# EAGLE schematic speakerbadge_thruvias (EAGLE 5.11)

## Sheet 1 of 2
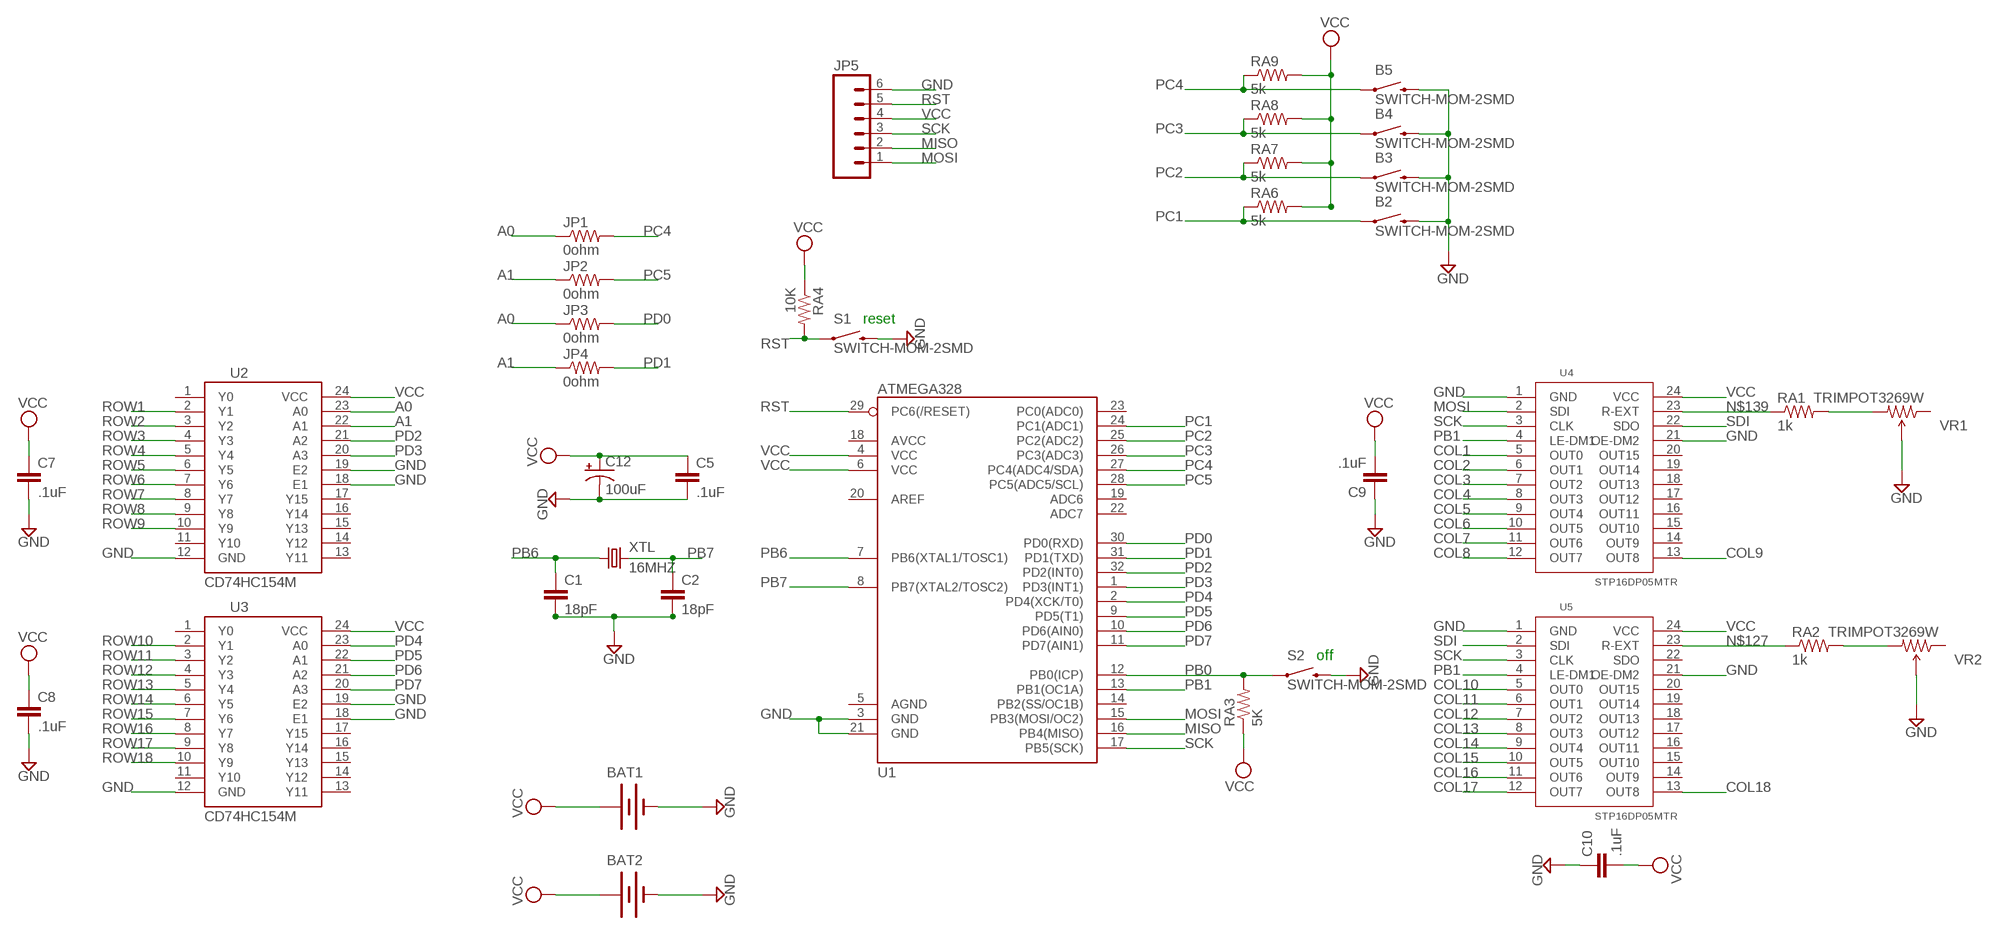
[diagram p0: schematic, sheet 1]

### Parts
B2  SWITCH-MOM-2SMD  SWITCH-MOMENTARY-2SMD  [TACTILE_SWITCH_SMD]
B3  SWITCH-MOM-2SMD  SWITCH-MOMENTARY-2SMD  [TACTILE_SWITCH_SMD]
B4  SWITCH-MOM-2SMD  SWITCH-MOMENTARY-2SMD  [TACTILE_SWITCH_SMD]
B5  SWITCH-MOM-2SMD  SWITCH-MOMENTARY-2SMD  [TACTILE_SWITCH_SMD]
BAT1  NSL_SPARKFUN_BATTERY245MM  [NSL_SPARKFUN_BATTCON_245MM]
BAT2  NSL_SPARKFUN_BATTERY245MM  [NSL_SPARKFUN_BATTCON_245MM]
C1  18pF  SPARKFUN_CAP0603-CAP  [SPARKFUN_0603-CAP]
C2  18pF  SPARKFUN_CAP0603-CAP  [SPARKFUN_0603-CAP]
C5  .1uF  SPARKFUN_CAP0603-CAP  [SPARKFUN_0603-CAP]
C7  .1uF  SPARKFUN_CAP0603-CAP  [SPARKFUN_0603-CAP]
C8  .1uF  SPARKFUN_CAP0603-CAP  [SPARKFUN_0603-CAP]
C9  .1uF  SPARKFUN_CAP0603-CAP  [SPARKFUN_0603-CAP]
C10  .1uF  SPARKFUN_CAP0603-CAP  [SPARKFUN_0603-CAP]
C12  100uF  CAP_POLD  [PANASONIC_D]
JP1  0ohm  SPARKFUN_RESISTOR0603-RES  [SPARKFUN_0603-RES]
JP2  0ohm  SPARKFUN_RESISTOR0603-RES  [SPARKFUN_0603-RES]
JP3  0ohm  SPARKFUN_RESISTOR0603-RES  [SPARKFUN_0603-RES]
JP4  0ohm  SPARKFUN_RESISTOR0603-RES  [SPARKFUN_0603-RES]
JP5  M061X06-SMD_EDGE_FEMALE  [1X06-SMD_EDGE]
RA1  1k  SPARKFUN_RESISTOR0603-RES  [SPARKFUN_0603-RES]
RA2  1k  SPARKFUN_RESISTOR0603-RES  [SPARKFUN_0603-RES]
RA3  5K  SPARKFUN_RESISTOR0603-RES  [SPARKFUN_0603-RES]
RA4  10K  SPARKFUN_RESISTOR0603-RES  [SPARKFUN_0603-RES]
RA6  5k  SPARKFUN_RESISTOR0603-RES  [SPARKFUN_0603-RES]
RA7  5k  SPARKFUN_RESISTOR0603-RES  [SPARKFUN_0603-RES]
RA8  5k  SPARKFUN_RESISTOR0603-RES  [SPARKFUN_0603-RES]
RA9  5k  SPARKFUN_RESISTOR0603-RES  [SPARKFUN_0603-RES]
S1  SWITCH-MOM-2SMD  SWITCH-MOMENTARY-2SMD  [TACTILE_SWITCH_SMD]
S2  SWITCH-MOM-2SMD  SWITCH-MOMENTARY-2SMD  [TACTILE_SWITCH_SMD]
U1  ATMEGA328  ATMEGA168  [TQFP32-08]
U2  CD74HC154M  [SO-24DW]
U3  CD74HC154M  [SO-24DW]
U4  STP16DP05MTR  [STP16DP05MTR]
U5  STP16DP05MTR  [STP16DP05MTR]
VR1  TRIMPOT3269W  [3269W]
VR2  TRIMPOT3269W  [3269W]
XTL  16MHZ  CRYSTALSMD  [HC49UP]

### Nets
A0: JP1.1 JP3.1 U2.23(A0)
A1: JP2.1 JP4.1 U2.22(A1)
COL1: U4.5(OUT0) ; also sheet 2
COL2: U4.6(OUT1) ; also sheet 2
COL3: U4.7(OUT2) ; also sheet 2
COL4: U4.8(OUT3) ; also sheet 2
COL5: U4.9(OUT4) ; also sheet 2
COL6: U4.10(OUT5) ; also sheet 2
COL7: U4.11(OUT6) ; also sheet 2
COL8: U4.12(OUT7) ; also sheet 2
COL9: U4.13(OUT8) ; also sheet 2
COL10: U5.5(OUT0) ; also sheet 2
COL11: U5.6(OUT1) ; also sheet 2
COL12: U5.7(OUT2) ; also sheet 2
COL13: U5.8(OUT3) ; also sheet 2
COL14: U5.9(OUT4) ; also sheet 2
COL15: U5.10(OUT5) ; also sheet 2
COL16: U5.11(OUT6) ; also sheet 2
COL17: U5.12(OUT7) ; also sheet 2
COL18: U5.13(OUT8) ; also sheet 2
GND: B2.3 B3.3 B4.3 B5.3 BAT1.2(-) BAT2.2(-) C1.2 C2.2 C5.2 C7.2 C8.2 C9.1 C10.1 C12.- JP5.6 S1.3 S2.3 U1.3(GND) U1.21(GND) U2.12(GND) U2.18(E1) U2.19(E2) U3.12(GND) U3.18(E1) U3.19(E2) U4.1(GND) U4.21(OE-DM2) U5.1(GND) U5.21(OE-DM2) VR1.2(WIPER) VR2.2(WIPER)
MISO: JP5.2 U1.16(PB4(MISO))
MOSI: JP5.1 U1.15(PB3(MOSI/OC2)) U4.2(SDI)
N$37: RA1.2 VR1.3(CW)
N$38: RA2.2 VR2.3(CW)
N$127: RA2.1 U5.23(R-EXT)
N$139: RA1.1 U4.23(R-EXT)
PB0: RA3.2 S2.1 U1.12(PB0(ICP))
PB1: U1.13(PB1(OC1A)) U4.4(LE-DM1) U5.4(LE-DM1)
PB6: C1.1 U1.7(PB6(XTAL1/TOSC1)) XTL.1
PB7: C2.1 U1.8(PB7(XTAL2/TOSC2)) XTL.2
PC1: B2.1 RA6.1 U1.24(PC1(ADC1))
PC2: B3.1 RA7.1 U1.25(PC2(ADC2))
PC3: B4.1 RA8.1 U1.26(PC3(ADC3))
PC4: B5.1 JP1.2 RA9.1 U1.27(PC4(ADC4/SDA))
PC5: JP2.2 U1.28(PC5(ADC5/SCL))
PD0: JP3.2 U1.30(PD0(RXD))
PD1: JP4.2 U1.31(PD1(TXD))
PD2: U1.32(PD2(INT0)) U2.21(A2)
PD3: U1.1(PD3(INT1)) U2.20(A3)
PD4: U1.2(PD4(XCK/T0)) U3.23(A0)
PD5: U1.9(PD5(T1)) U3.22(A1)
PD6: U1.10(PD6(AIN0)) U3.21(A2)
PD7: U1.11(PD7(AIN1)) U3.20(A3)
ROW1: U2.2(Y1) ; also sheet 2
ROW2: U2.3(Y2) ; also sheet 2
ROW3: U2.4(Y3) ; also sheet 2
ROW4: U2.5(Y4) ; also sheet 2
ROW5: U2.6(Y5) ; also sheet 2
ROW6: U2.7(Y6) ; also sheet 2
ROW7: U2.8(Y7) ; also sheet 2
ROW8: U2.9(Y8) ; also sheet 2
ROW9: U2.10(Y9) ; also sheet 2
ROW10: U3.2(Y1) ; also sheet 2
ROW11: U3.3(Y2) ; also sheet 2
ROW12: U3.4(Y3) ; also sheet 2
ROW13: U3.5(Y4) ; also sheet 2
ROW14: U3.6(Y5) ; also sheet 2
ROW15: U3.7(Y6) ; also sheet 2
ROW16: U3.8(Y7) ; also sheet 2
ROW17: U3.9(Y8) ; also sheet 2
ROW18: U3.10(Y9) ; also sheet 2
RST: JP5.5 RA4.2 S1.1 U1.29(PC6(/RESET))
SCK: JP5.3 U1.17(PB5(SCK)) U4.3(CLK) U5.3(CLK)
SDI: U4.22(SDO) U5.2(SDI)
VCC: BAT1.1(+) BAT2.1(+) C5.1 C7.1 C8.1 C9.2 C10.2 C12.+ JP5.4 RA3.1 RA4.1 RA6.2 RA7.2 RA8.2 RA9.2 U1.4(VCC) U1.6(VCC) U2.24(VCC) U3.24(VCC) U4.24(VCC) U5.24(VCC) ; also sheet 2
Unconnected: U1.5(AGND) U1.14(PB2(SS/OC1B)) U1.18(AVCC) U1.19(ADC6) U1.20(AREF) U1.22(ADC7) U1.23(PC0(ADC0)) U2.1(Y0) U2.11(Y10) U2.13(Y11) U2.14(Y12) U2.15(Y13) U2.16(Y14) U2.17(Y15) U3.1(Y0) U3.11(Y10) U3.13(Y11) U3.14(Y12) U3.15(Y13) U3.16(Y14) U3.17(Y15) U4.14(OUT9) U4.15(OUT10) U4.16(OUT11) U4.17(OUT12) U4.18(OUT13) U4.19(OUT14) U4.20(OUT15) U5.14(OUT9) U5.15(OUT10) U5.16(OUT11) U5.17(OUT12) U5.18(OUT13) U5.19(OUT14) U5.20(OUT15) U5.22(SDO) VR1.1(CCW) VR2.1(CCW)

### Notes on the sheet
- reset
- off

## Sheet 2 of 2
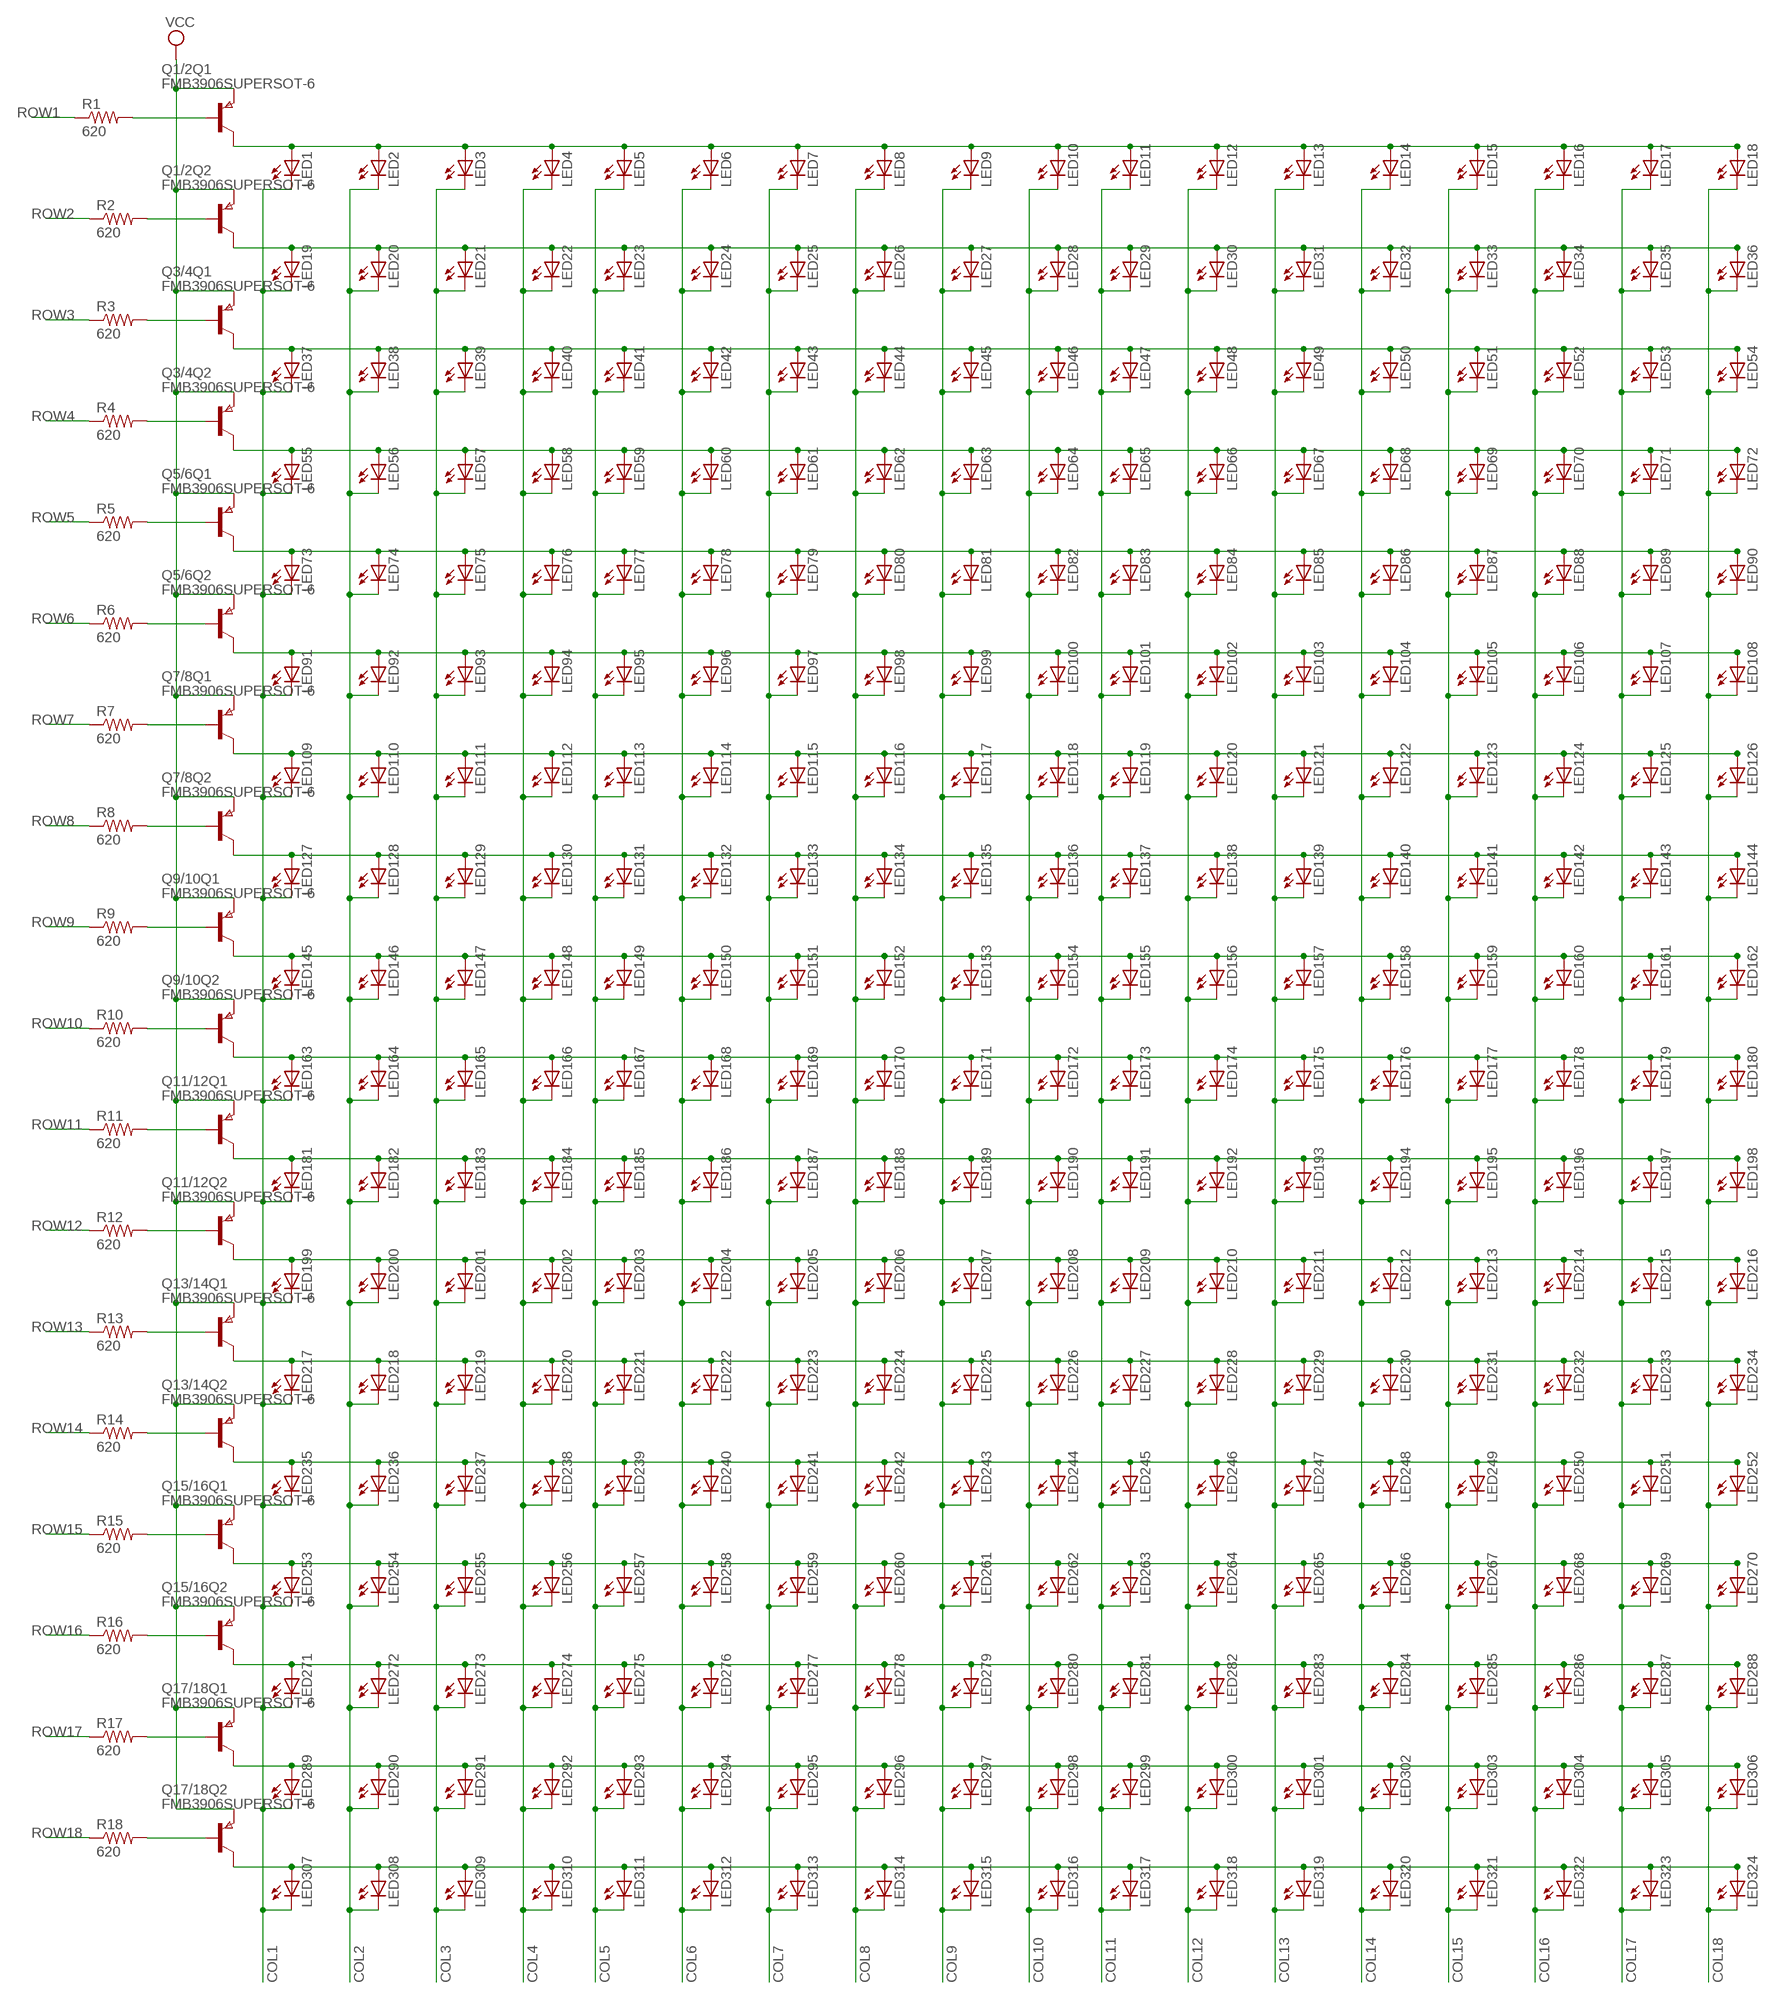
[diagram p1: schematic, sheet 2]

### Parts
LED1  NSL_SPARKFUN_LED0603  [NSL_SPARKFUN_LED-0603]
LED2  NSL_SPARKFUN_LED0603  [NSL_SPARKFUN_LED-0603]
LED3  NSL_SPARKFUN_LED0603  [NSL_SPARKFUN_LED-0603]
LED4  NSL_SPARKFUN_LED0603  [NSL_SPARKFUN_LED-0603]
LED5  NSL_SPARKFUN_LED0603  [NSL_SPARKFUN_LED-0603]
LED6  NSL_SPARKFUN_LED0603  [NSL_SPARKFUN_LED-0603]
LED7  NSL_SPARKFUN_LED0603  [NSL_SPARKFUN_LED-0603]
LED8  NSL_SPARKFUN_LED0603  [NSL_SPARKFUN_LED-0603]
LED9  NSL_SPARKFUN_LED0603  [NSL_SPARKFUN_LED-0603]
LED10  NSL_SPARKFUN_LED0603  [NSL_SPARKFUN_LED-0603]
LED11  NSL_SPARKFUN_LED0603  [NSL_SPARKFUN_LED-0603]
LED12  NSL_SPARKFUN_LED0603  [NSL_SPARKFUN_LED-0603]
LED13  NSL_SPARKFUN_LED0603  [NSL_SPARKFUN_LED-0603]
LED14  NSL_SPARKFUN_LED0603  [NSL_SPARKFUN_LED-0603]
LED15  NSL_SPARKFUN_LED0603  [NSL_SPARKFUN_LED-0603]
LED16  NSL_SPARKFUN_LED0603  [NSL_SPARKFUN_LED-0603]
LED17  NSL_SPARKFUN_LED0603  [NSL_SPARKFUN_LED-0603]
LED18  NSL_SPARKFUN_LED0603  [NSL_SPARKFUN_LED-0603]
LED19  NSL_SPARKFUN_LED0603  [NSL_SPARKFUN_LED-0603]
LED20  NSL_SPARKFUN_LED0603  [NSL_SPARKFUN_LED-0603]
LED21  NSL_SPARKFUN_LED0603  [NSL_SPARKFUN_LED-0603]
LED22  NSL_SPARKFUN_LED0603  [NSL_SPARKFUN_LED-0603]
LED23  NSL_SPARKFUN_LED0603  [NSL_SPARKFUN_LED-0603]
LED24  NSL_SPARKFUN_LED0603  [NSL_SPARKFUN_LED-0603]
LED25  NSL_SPARKFUN_LED0603  [NSL_SPARKFUN_LED-0603]
LED26  NSL_SPARKFUN_LED0603  [NSL_SPARKFUN_LED-0603]
LED27  NSL_SPARKFUN_LED0603  [NSL_SPARKFUN_LED-0603]
LED28  NSL_SPARKFUN_LED0603  [NSL_SPARKFUN_LED-0603]
LED29  NSL_SPARKFUN_LED0603  [NSL_SPARKFUN_LED-0603]
LED30  NSL_SPARKFUN_LED0603  [NSL_SPARKFUN_LED-0603]
LED31  NSL_SPARKFUN_LED0603  [NSL_SPARKFUN_LED-0603]
LED32  NSL_SPARKFUN_LED0603  [NSL_SPARKFUN_LED-0603]
LED33  NSL_SPARKFUN_LED0603  [NSL_SPARKFUN_LED-0603]
LED34  NSL_SPARKFUN_LED0603  [NSL_SPARKFUN_LED-0603]
LED35  NSL_SPARKFUN_LED0603  [NSL_SPARKFUN_LED-0603]
LED36  NSL_SPARKFUN_LED0603  [NSL_SPARKFUN_LED-0603]
LED37  NSL_SPARKFUN_LED0603  [NSL_SPARKFUN_LED-0603]
LED38  NSL_SPARKFUN_LED0603  [NSL_SPARKFUN_LED-0603]
LED39  NSL_SPARKFUN_LED0603  [NSL_SPARKFUN_LED-0603]
LED40  NSL_SPARKFUN_LED0603  [NSL_SPARKFUN_LED-0603]
LED41  NSL_SPARKFUN_LED0603  [NSL_SPARKFUN_LED-0603]
LED42  NSL_SPARKFUN_LED0603  [NSL_SPARKFUN_LED-0603]
LED43  NSL_SPARKFUN_LED0603  [NSL_SPARKFUN_LED-0603]
LED44  NSL_SPARKFUN_LED0603  [NSL_SPARKFUN_LED-0603]
LED45  NSL_SPARKFUN_LED0603  [NSL_SPARKFUN_LED-0603]
LED46  NSL_SPARKFUN_LED0603  [NSL_SPARKFUN_LED-0603]
LED47  NSL_SPARKFUN_LED0603  [NSL_SPARKFUN_LED-0603]
LED48  NSL_SPARKFUN_LED0603  [NSL_SPARKFUN_LED-0603]
LED49  NSL_SPARKFUN_LED0603  [NSL_SPARKFUN_LED-0603]
LED50  NSL_SPARKFUN_LED0603  [NSL_SPARKFUN_LED-0603]
LED51  NSL_SPARKFUN_LED0603  [NSL_SPARKFUN_LED-0603]
LED52  NSL_SPARKFUN_LED0603  [NSL_SPARKFUN_LED-0603]
LED53  NSL_SPARKFUN_LED0603  [NSL_SPARKFUN_LED-0603]
LED54  NSL_SPARKFUN_LED0603  [NSL_SPARKFUN_LED-0603]
LED55  NSL_SPARKFUN_LED0603  [NSL_SPARKFUN_LED-0603]
LED56  NSL_SPARKFUN_LED0603  [NSL_SPARKFUN_LED-0603]
LED57  NSL_SPARKFUN_LED0603  [NSL_SPARKFUN_LED-0603]
LED58  NSL_SPARKFUN_LED0603  [NSL_SPARKFUN_LED-0603]
LED59  NSL_SPARKFUN_LED0603  [NSL_SPARKFUN_LED-0603]
LED60  NSL_SPARKFUN_LED0603  [NSL_SPARKFUN_LED-0603]
LED61  NSL_SPARKFUN_LED0603  [NSL_SPARKFUN_LED-0603]
LED62  NSL_SPARKFUN_LED0603  [NSL_SPARKFUN_LED-0603]
LED63  NSL_SPARKFUN_LED0603  [NSL_SPARKFUN_LED-0603]
LED64  NSL_SPARKFUN_LED0603  [NSL_SPARKFUN_LED-0603]
LED65  NSL_SPARKFUN_LED0603  [NSL_SPARKFUN_LED-0603]
LED66  NSL_SPARKFUN_LED0603  [NSL_SPARKFUN_LED-0603]
LED67  NSL_SPARKFUN_LED0603  [NSL_SPARKFUN_LED-0603]
LED68  NSL_SPARKFUN_LED0603  [NSL_SPARKFUN_LED-0603]
LED69  NSL_SPARKFUN_LED0603  [NSL_SPARKFUN_LED-0603]
LED70  NSL_SPARKFUN_LED0603  [NSL_SPARKFUN_LED-0603]
LED71  NSL_SPARKFUN_LED0603  [NSL_SPARKFUN_LED-0603]
LED72  NSL_SPARKFUN_LED0603  [NSL_SPARKFUN_LED-0603]
LED73  NSL_SPARKFUN_LED0603  [NSL_SPARKFUN_LED-0603]
LED74  NSL_SPARKFUN_LED0603  [NSL_SPARKFUN_LED-0603]
LED75  NSL_SPARKFUN_LED0603  [NSL_SPARKFUN_LED-0603]
LED76  NSL_SPARKFUN_LED0603  [NSL_SPARKFUN_LED-0603]
LED77  NSL_SPARKFUN_LED0603  [NSL_SPARKFUN_LED-0603]
LED78  NSL_SPARKFUN_LED0603  [NSL_SPARKFUN_LED-0603]
LED79  NSL_SPARKFUN_LED0603  [NSL_SPARKFUN_LED-0603]
LED80  NSL_SPARKFUN_LED0603  [NSL_SPARKFUN_LED-0603]
LED81  NSL_SPARKFUN_LED0603  [NSL_SPARKFUN_LED-0603]
LED82  NSL_SPARKFUN_LED0603  [NSL_SPARKFUN_LED-0603]
LED83  NSL_SPARKFUN_LED0603  [NSL_SPARKFUN_LED-0603]
LED84  NSL_SPARKFUN_LED0603  [NSL_SPARKFUN_LED-0603]
LED85  NSL_SPARKFUN_LED0603  [NSL_SPARKFUN_LED-0603]
LED86  NSL_SPARKFUN_LED0603  [NSL_SPARKFUN_LED-0603]
LED87  NSL_SPARKFUN_LED0603  [NSL_SPARKFUN_LED-0603]
LED88  NSL_SPARKFUN_LED0603  [NSL_SPARKFUN_LED-0603]
LED89  NSL_SPARKFUN_LED0603  [NSL_SPARKFUN_LED-0603]
LED90  NSL_SPARKFUN_LED0603  [NSL_SPARKFUN_LED-0603]
LED91  NSL_SPARKFUN_LED0603  [NSL_SPARKFUN_LED-0603]
LED92  NSL_SPARKFUN_LED0603  [NSL_SPARKFUN_LED-0603]
LED93  NSL_SPARKFUN_LED0603  [NSL_SPARKFUN_LED-0603]
LED94  NSL_SPARKFUN_LED0603  [NSL_SPARKFUN_LED-0603]
LED95  NSL_SPARKFUN_LED0603  [NSL_SPARKFUN_LED-0603]
LED96  NSL_SPARKFUN_LED0603  [NSL_SPARKFUN_LED-0603]
LED97  NSL_SPARKFUN_LED0603  [NSL_SPARKFUN_LED-0603]
LED98  NSL_SPARKFUN_LED0603  [NSL_SPARKFUN_LED-0603]
LED99  NSL_SPARKFUN_LED0603  [NSL_SPARKFUN_LED-0603]
LED100  NSL_SPARKFUN_LED0603  [NSL_SPARKFUN_LED-0603]
LED101  NSL_SPARKFUN_LED0603  [NSL_SPARKFUN_LED-0603]
LED102  NSL_SPARKFUN_LED0603  [NSL_SPARKFUN_LED-0603]
LED103  NSL_SPARKFUN_LED0603  [NSL_SPARKFUN_LED-0603]
LED104  NSL_SPARKFUN_LED0603  [NSL_SPARKFUN_LED-0603]
LED105  NSL_SPARKFUN_LED0603  [NSL_SPARKFUN_LED-0603]
LED106  NSL_SPARKFUN_LED0603  [NSL_SPARKFUN_LED-0603]
LED107  NSL_SPARKFUN_LED0603  [NSL_SPARKFUN_LED-0603]
LED108  NSL_SPARKFUN_LED0603  [NSL_SPARKFUN_LED-0603]
LED109  NSL_SPARKFUN_LED0603  [NSL_SPARKFUN_LED-0603]
LED110  NSL_SPARKFUN_LED0603  [NSL_SPARKFUN_LED-0603]
LED111  NSL_SPARKFUN_LED0603  [NSL_SPARKFUN_LED-0603]
LED112  NSL_SPARKFUN_LED0603  [NSL_SPARKFUN_LED-0603]
LED113  NSL_SPARKFUN_LED0603  [NSL_SPARKFUN_LED-0603]
LED114  NSL_SPARKFUN_LED0603  [NSL_SPARKFUN_LED-0603]
LED115  NSL_SPARKFUN_LED0603  [NSL_SPARKFUN_LED-0603]
LED116  NSL_SPARKFUN_LED0603  [NSL_SPARKFUN_LED-0603]
LED117  NSL_SPARKFUN_LED0603  [NSL_SPARKFUN_LED-0603]
LED118  NSL_SPARKFUN_LED0603  [NSL_SPARKFUN_LED-0603]
LED119  NSL_SPARKFUN_LED0603  [NSL_SPARKFUN_LED-0603]
LED120  NSL_SPARKFUN_LED0603  [NSL_SPARKFUN_LED-0603]
LED121  NSL_SPARKFUN_LED0603  [NSL_SPARKFUN_LED-0603]
LED122  NSL_SPARKFUN_LED0603  [NSL_SPARKFUN_LED-0603]
LED123  NSL_SPARKFUN_LED0603  [NSL_SPARKFUN_LED-0603]
LED124  NSL_SPARKFUN_LED0603  [NSL_SPARKFUN_LED-0603]
LED125  NSL_SPARKFUN_LED0603  [NSL_SPARKFUN_LED-0603]
LED126  NSL_SPARKFUN_LED0603  [NSL_SPARKFUN_LED-0603]
LED127  NSL_SPARKFUN_LED0603  [NSL_SPARKFUN_LED-0603]
LED128  NSL_SPARKFUN_LED0603  [NSL_SPARKFUN_LED-0603]
LED129  NSL_SPARKFUN_LED0603  [NSL_SPARKFUN_LED-0603]
LED130  NSL_SPARKFUN_LED0603  [NSL_SPARKFUN_LED-0603]
LED131  NSL_SPARKFUN_LED0603  [NSL_SPARKFUN_LED-0603]
LED132  NSL_SPARKFUN_LED0603  [NSL_SPARKFUN_LED-0603]
LED133  NSL_SPARKFUN_LED0603  [NSL_SPARKFUN_LED-0603]
LED134  NSL_SPARKFUN_LED0603  [NSL_SPARKFUN_LED-0603]
LED135  NSL_SPARKFUN_LED0603  [NSL_SPARKFUN_LED-0603]
LED136  NSL_SPARKFUN_LED0603  [NSL_SPARKFUN_LED-0603]
LED137  NSL_SPARKFUN_LED0603  [NSL_SPARKFUN_LED-0603]
LED138  NSL_SPARKFUN_LED0603  [NSL_SPARKFUN_LED-0603]
LED139  NSL_SPARKFUN_LED0603  [NSL_SPARKFUN_LED-0603]
LED140  NSL_SPARKFUN_LED0603  [NSL_SPARKFUN_LED-0603]
LED141  NSL_SPARKFUN_LED0603  [NSL_SPARKFUN_LED-0603]
LED142  NSL_SPARKFUN_LED0603  [NSL_SPARKFUN_LED-0603]
LED143  NSL_SPARKFUN_LED0603  [NSL_SPARKFUN_LED-0603]
LED144  NSL_SPARKFUN_LED0603  [NSL_SPARKFUN_LED-0603]
LED145  NSL_SPARKFUN_LED0603  [NSL_SPARKFUN_LED-0603]
LED146  NSL_SPARKFUN_LED0603  [NSL_SPARKFUN_LED-0603]
LED147  NSL_SPARKFUN_LED0603  [NSL_SPARKFUN_LED-0603]
LED148  NSL_SPARKFUN_LED0603  [NSL_SPARKFUN_LED-0603]
LED149  NSL_SPARKFUN_LED0603  [NSL_SPARKFUN_LED-0603]
LED150  NSL_SPARKFUN_LED0603  [NSL_SPARKFUN_LED-0603]
LED151  NSL_SPARKFUN_LED0603  [NSL_SPARKFUN_LED-0603]
LED152  NSL_SPARKFUN_LED0603  [NSL_SPARKFUN_LED-0603]
LED153  NSL_SPARKFUN_LED0603  [NSL_SPARKFUN_LED-0603]
LED154  NSL_SPARKFUN_LED0603  [NSL_SPARKFUN_LED-0603]
LED155  NSL_SPARKFUN_LED0603  [NSL_SPARKFUN_LED-0603]
LED156  NSL_SPARKFUN_LED0603  [NSL_SPARKFUN_LED-0603]
LED157  NSL_SPARKFUN_LED0603  [NSL_SPARKFUN_LED-0603]
LED158  NSL_SPARKFUN_LED0603  [NSL_SPARKFUN_LED-0603]
LED159  NSL_SPARKFUN_LED0603  [NSL_SPARKFUN_LED-0603]
LED160  NSL_SPARKFUN_LED0603  [NSL_SPARKFUN_LED-0603]
LED161  NSL_SPARKFUN_LED0603  [NSL_SPARKFUN_LED-0603]
LED162  NSL_SPARKFUN_LED0603  [NSL_SPARKFUN_LED-0603]
LED163  NSL_SPARKFUN_LED0603  [NSL_SPARKFUN_LED-0603]
LED164  NSL_SPARKFUN_LED0603  [NSL_SPARKFUN_LED-0603]
LED165  NSL_SPARKFUN_LED0603  [NSL_SPARKFUN_LED-0603]
LED166  NSL_SPARKFUN_LED0603  [NSL_SPARKFUN_LED-0603]
LED167  NSL_SPARKFUN_LED0603  [NSL_SPARKFUN_LED-0603]
LED168  NSL_SPARKFUN_LED0603  [NSL_SPARKFUN_LED-0603]
LED169  NSL_SPARKFUN_LED0603  [NSL_SPARKFUN_LED-0603]
LED170  NSL_SPARKFUN_LED0603  [NSL_SPARKFUN_LED-0603]
LED171  NSL_SPARKFUN_LED0603  [NSL_SPARKFUN_LED-0603]
LED172  NSL_SPARKFUN_LED0603  [NSL_SPARKFUN_LED-0603]
LED173  NSL_SPARKFUN_LED0603  [NSL_SPARKFUN_LED-0603]
LED174  NSL_SPARKFUN_LED0603  [NSL_SPARKFUN_LED-0603]
LED175  NSL_SPARKFUN_LED0603  [NSL_SPARKFUN_LED-0603]
LED176  NSL_SPARKFUN_LED0603  [NSL_SPARKFUN_LED-0603]
LED177  NSL_SPARKFUN_LED0603  [NSL_SPARKFUN_LED-0603]
LED178  NSL_SPARKFUN_LED0603  [NSL_SPARKFUN_LED-0603]
LED179  NSL_SPARKFUN_LED0603  [NSL_SPARKFUN_LED-0603]
LED180  NSL_SPARKFUN_LED0603  [NSL_SPARKFUN_LED-0603]
LED181  NSL_SPARKFUN_LED0603  [NSL_SPARKFUN_LED-0603]
LED182  NSL_SPARKFUN_LED0603  [NSL_SPARKFUN_LED-0603]
LED183  NSL_SPARKFUN_LED0603  [NSL_SPARKFUN_LED-0603]
LED184  NSL_SPARKFUN_LED0603  [NSL_SPARKFUN_LED-0603]
LED185  NSL_SPARKFUN_LED0603  [NSL_SPARKFUN_LED-0603]
LED186  NSL_SPARKFUN_LED0603  [NSL_SPARKFUN_LED-0603]
LED187  NSL_SPARKFUN_LED0603  [NSL_SPARKFUN_LED-0603]
LED188  NSL_SPARKFUN_LED0603  [NSL_SPARKFUN_LED-0603]
LED189  NSL_SPARKFUN_LED0603  [NSL_SPARKFUN_LED-0603]
LED190  NSL_SPARKFUN_LED0603  [NSL_SPARKFUN_LED-0603]
LED191  NSL_SPARKFUN_LED0603  [NSL_SPARKFUN_LED-0603]
LED192  NSL_SPARKFUN_LED0603  [NSL_SPARKFUN_LED-0603]
LED193  NSL_SPARKFUN_LED0603  [NSL_SPARKFUN_LED-0603]
LED194  NSL_SPARKFUN_LED0603  [NSL_SPARKFUN_LED-0603]
LED195  NSL_SPARKFUN_LED0603  [NSL_SPARKFUN_LED-0603]
LED196  NSL_SPARKFUN_LED0603  [NSL_SPARKFUN_LED-0603]
LED197  NSL_SPARKFUN_LED0603  [NSL_SPARKFUN_LED-0603]
LED198  NSL_SPARKFUN_LED0603  [NSL_SPARKFUN_LED-0603]
LED199  NSL_SPARKFUN_LED0603  [NSL_SPARKFUN_LED-0603]
LED200  NSL_SPARKFUN_LED0603  [NSL_SPARKFUN_LED-0603]
LED201  NSL_SPARKFUN_LED0603  [NSL_SPARKFUN_LED-0603]
LED202  NSL_SPARKFUN_LED0603  [NSL_SPARKFUN_LED-0603]
LED203  NSL_SPARKFUN_LED0603  [NSL_SPARKFUN_LED-0603]
LED204  NSL_SPARKFUN_LED0603  [NSL_SPARKFUN_LED-0603]
LED205  NSL_SPARKFUN_LED0603  [NSL_SPARKFUN_LED-0603]
LED206  NSL_SPARKFUN_LED0603  [NSL_SPARKFUN_LED-0603]
LED207  NSL_SPARKFUN_LED0603  [NSL_SPARKFUN_LED-0603]
LED208  NSL_SPARKFUN_LED0603  [NSL_SPARKFUN_LED-0603]
LED209  NSL_SPARKFUN_LED0603  [NSL_SPARKFUN_LED-0603]
LED210  NSL_SPARKFUN_LED0603  [NSL_SPARKFUN_LED-0603]
LED211  NSL_SPARKFUN_LED0603  [NSL_SPARKFUN_LED-0603]
LED212  NSL_SPARKFUN_LED0603  [NSL_SPARKFUN_LED-0603]
LED213  NSL_SPARKFUN_LED0603  [NSL_SPARKFUN_LED-0603]
LED214  NSL_SPARKFUN_LED0603  [NSL_SPARKFUN_LED-0603]
LED215  NSL_SPARKFUN_LED0603  [NSL_SPARKFUN_LED-0603]
LED216  NSL_SPARKFUN_LED0603  [NSL_SPARKFUN_LED-0603]
LED217  NSL_SPARKFUN_LED0603  [NSL_SPARKFUN_LED-0603]
LED218  NSL_SPARKFUN_LED0603  [NSL_SPARKFUN_LED-0603]
LED219  NSL_SPARKFUN_LED0603  [NSL_SPARKFUN_LED-0603]
LED220  NSL_SPARKFUN_LED0603  [NSL_SPARKFUN_LED-0603]
LED221  NSL_SPARKFUN_LED0603  [NSL_SPARKFUN_LED-0603]
LED222  NSL_SPARKFUN_LED0603  [NSL_SPARKFUN_LED-0603]
LED223  NSL_SPARKFUN_LED0603  [NSL_SPARKFUN_LED-0603]
LED224  NSL_SPARKFUN_LED0603  [NSL_SPARKFUN_LED-0603]
LED225  NSL_SPARKFUN_LED0603  [NSL_SPARKFUN_LED-0603]
LED226  NSL_SPARKFUN_LED0603  [NSL_SPARKFUN_LED-0603]
LED227  NSL_SPARKFUN_LED0603  [NSL_SPARKFUN_LED-0603]
LED228  NSL_SPARKFUN_LED0603  [NSL_SPARKFUN_LED-0603]
LED229  NSL_SPARKFUN_LED0603  [NSL_SPARKFUN_LED-0603]
LED230  NSL_SPARKFUN_LED0603  [NSL_SPARKFUN_LED-0603]
LED231  NSL_SPARKFUN_LED0603  [NSL_SPARKFUN_LED-0603]
LED232  NSL_SPARKFUN_LED0603  [NSL_SPARKFUN_LED-0603]
LED233  NSL_SPARKFUN_LED0603  [NSL_SPARKFUN_LED-0603]
LED234  NSL_SPARKFUN_LED0603  [NSL_SPARKFUN_LED-0603]
LED235  NSL_SPARKFUN_LED0603  [NSL_SPARKFUN_LED-0603]
LED236  NSL_SPARKFUN_LED0603  [NSL_SPARKFUN_LED-0603]
LED237  NSL_SPARKFUN_LED0603  [NSL_SPARKFUN_LED-0603]
LED238  NSL_SPARKFUN_LED0603  [NSL_SPARKFUN_LED-0603]
LED239  NSL_SPARKFUN_LED0603  [NSL_SPARKFUN_LED-0603]
LED240  NSL_SPARKFUN_LED0603  [NSL_SPARKFUN_LED-0603]
LED241  NSL_SPARKFUN_LED0603  [NSL_SPARKFUN_LED-0603]
LED242  NSL_SPARKFUN_LED0603  [NSL_SPARKFUN_LED-0603]
LED243  NSL_SPARKFUN_LED0603  [NSL_SPARKFUN_LED-0603]
LED244  NSL_SPARKFUN_LED0603  [NSL_SPARKFUN_LED-0603]
LED245  NSL_SPARKFUN_LED0603  [NSL_SPARKFUN_LED-0603]
LED246  NSL_SPARKFUN_LED0603  [NSL_SPARKFUN_LED-0603]
LED247  NSL_SPARKFUN_LED0603  [NSL_SPARKFUN_LED-0603]
LED248  NSL_SPARKFUN_LED0603  [NSL_SPARKFUN_LED-0603]
LED249  NSL_SPARKFUN_LED0603  [NSL_SPARKFUN_LED-0603]
LED250  NSL_SPARKFUN_LED0603  [NSL_SPARKFUN_LED-0603]
LED251  NSL_SPARKFUN_LED0603  [NSL_SPARKFUN_LED-0603]
LED252  NSL_SPARKFUN_LED0603  [NSL_SPARKFUN_LED-0603]
LED253  NSL_SPARKFUN_LED0603  [NSL_SPARKFUN_LED-0603]
LED254  NSL_SPARKFUN_LED0603  [NSL_SPARKFUN_LED-0603]
LED255  NSL_SPARKFUN_LED0603  [NSL_SPARKFUN_LED-0603]
LED256  NSL_SPARKFUN_LED0603  [NSL_SPARKFUN_LED-0603]
LED257  NSL_SPARKFUN_LED0603  [NSL_SPARKFUN_LED-0603]
LED258  NSL_SPARKFUN_LED0603  [NSL_SPARKFUN_LED-0603]
LED259  NSL_SPARKFUN_LED0603  [NSL_SPARKFUN_LED-0603]
LED260  NSL_SPARKFUN_LED0603  [NSL_SPARKFUN_LED-0603]
LED261  NSL_SPARKFUN_LED0603  [NSL_SPARKFUN_LED-0603]
LED262  NSL_SPARKFUN_LED0603  [NSL_SPARKFUN_LED-0603]
LED263  NSL_SPARKFUN_LED0603  [NSL_SPARKFUN_LED-0603]
LED264  NSL_SPARKFUN_LED0603  [NSL_SPARKFUN_LED-0603]
LED265  NSL_SPARKFUN_LED0603  [NSL_SPARKFUN_LED-0603]
LED266  NSL_SPARKFUN_LED0603  [NSL_SPARKFUN_LED-0603]
LED267  NSL_SPARKFUN_LED0603  [NSL_SPARKFUN_LED-0603]
LED268  NSL_SPARKFUN_LED0603  [NSL_SPARKFUN_LED-0603]
LED269  NSL_SPARKFUN_LED0603  [NSL_SPARKFUN_LED-0603]
LED270  NSL_SPARKFUN_LED0603  [NSL_SPARKFUN_LED-0603]
LED271  NSL_SPARKFUN_LED0603  [NSL_SPARKFUN_LED-0603]
LED272  NSL_SPARKFUN_LED0603  [NSL_SPARKFUN_LED-0603]
LED273  NSL_SPARKFUN_LED0603  [NSL_SPARKFUN_LED-0603]
LED274  NSL_SPARKFUN_LED0603  [NSL_SPARKFUN_LED-0603]
LED275  NSL_SPARKFUN_LED0603  [NSL_SPARKFUN_LED-0603]
LED276  NSL_SPARKFUN_LED0603  [NSL_SPARKFUN_LED-0603]
LED277  NSL_SPARKFUN_LED0603  [NSL_SPARKFUN_LED-0603]
LED278  NSL_SPARKFUN_LED0603  [NSL_SPARKFUN_LED-0603]
LED279  NSL_SPARKFUN_LED0603  [NSL_SPARKFUN_LED-0603]
LED280  NSL_SPARKFUN_LED0603  [NSL_SPARKFUN_LED-0603]
LED281  NSL_SPARKFUN_LED0603  [NSL_SPARKFUN_LED-0603]
LED282  NSL_SPARKFUN_LED0603  [NSL_SPARKFUN_LED-0603]
LED283  NSL_SPARKFUN_LED0603  [NSL_SPARKFUN_LED-0603]
LED284  NSL_SPARKFUN_LED0603  [NSL_SPARKFUN_LED-0603]
LED285  NSL_SPARKFUN_LED0603  [NSL_SPARKFUN_LED-0603]
LED286  NSL_SPARKFUN_LED0603  [NSL_SPARKFUN_LED-0603]
LED287  NSL_SPARKFUN_LED0603  [NSL_SPARKFUN_LED-0603]
LED288  NSL_SPARKFUN_LED0603  [NSL_SPARKFUN_LED-0603]
LED289  NSL_SPARKFUN_LED0603  [NSL_SPARKFUN_LED-0603]
LED290  NSL_SPARKFUN_LED0603  [NSL_SPARKFUN_LED-0603]
LED291  NSL_SPARKFUN_LED0603  [NSL_SPARKFUN_LED-0603]
LED292  NSL_SPARKFUN_LED0603  [NSL_SPARKFUN_LED-0603]
LED293  NSL_SPARKFUN_LED0603  [NSL_SPARKFUN_LED-0603]
LED294  NSL_SPARKFUN_LED0603  [NSL_SPARKFUN_LED-0603]
LED295  NSL_SPARKFUN_LED0603  [NSL_SPARKFUN_LED-0603]
LED296  NSL_SPARKFUN_LED0603  [NSL_SPARKFUN_LED-0603]
LED297  NSL_SPARKFUN_LED0603  [NSL_SPARKFUN_LED-0603]
LED298  NSL_SPARKFUN_LED0603  [NSL_SPARKFUN_LED-0603]
LED299  NSL_SPARKFUN_LED0603  [NSL_SPARKFUN_LED-0603]
LED300  NSL_SPARKFUN_LED0603  [NSL_SPARKFUN_LED-0603]
LED301  NSL_SPARKFUN_LED0603  [NSL_SPARKFUN_LED-0603]
LED302  NSL_SPARKFUN_LED0603  [NSL_SPARKFUN_LED-0603]
LED303  NSL_SPARKFUN_LED0603  [NSL_SPARKFUN_LED-0603]
LED304  NSL_SPARKFUN_LED0603  [NSL_SPARKFUN_LED-0603]
LED305  NSL_SPARKFUN_LED0603  [NSL_SPARKFUN_LED-0603]
LED306  NSL_SPARKFUN_LED0603  [NSL_SPARKFUN_LED-0603]
LED307  NSL_SPARKFUN_LED0603  [NSL_SPARKFUN_LED-0603]
LED308  NSL_SPARKFUN_LED0603  [NSL_SPARKFUN_LED-0603]
LED309  NSL_SPARKFUN_LED0603  [NSL_SPARKFUN_LED-0603]
LED310  NSL_SPARKFUN_LED0603  [NSL_SPARKFUN_LED-0603]
LED311  NSL_SPARKFUN_LED0603  [NSL_SPARKFUN_LED-0603]
LED312  NSL_SPARKFUN_LED0603  [NSL_SPARKFUN_LED-0603]
LED313  NSL_SPARKFUN_LED0603  [NSL_SPARKFUN_LED-0603]
LED314  NSL_SPARKFUN_LED0603  [NSL_SPARKFUN_LED-0603]
LED315  NSL_SPARKFUN_LED0603  [NSL_SPARKFUN_LED-0603]
LED316  NSL_SPARKFUN_LED0603  [NSL_SPARKFUN_LED-0603]
LED317  NSL_SPARKFUN_LED0603  [NSL_SPARKFUN_LED-0603]
LED318  NSL_SPARKFUN_LED0603  [NSL_SPARKFUN_LED-0603]
LED319  NSL_SPARKFUN_LED0603  [NSL_SPARKFUN_LED-0603]
LED320  NSL_SPARKFUN_LED0603  [NSL_SPARKFUN_LED-0603]
LED321  NSL_SPARKFUN_LED0603  [NSL_SPARKFUN_LED-0603]
LED322  NSL_SPARKFUN_LED0603  [NSL_SPARKFUN_LED-0603]
LED323  NSL_SPARKFUN_LED0603  [NSL_SPARKFUN_LED-0603]
LED324  NSL_SPARKFUN_LED0603  [NSL_SPARKFUN_LED-0603]
Q1/2  FMB3906SUPERSOT-6  [SSOT-6]
Q3/4  FMB3906SUPERSOT-6  [SSOT-6]
Q5/6  FMB3906SUPERSOT-6  [SSOT-6]
Q7/8  FMB3906SUPERSOT-6  [SSOT-6]
Q9/10  FMB3906SUPERSOT-6  [SSOT-6]
Q11/12  FMB3906SUPERSOT-6  [SSOT-6]
Q13/14  FMB3906SUPERSOT-6  [SSOT-6]
Q15/16  FMB3906SUPERSOT-6  [SSOT-6]
Q17/18  FMB3906SUPERSOT-6  [SSOT-6]
R1  620  SPARKFUN_RESISTOR0603-RES  [SPARKFUN_0603-RES]
R2  620  SPARKFUN_RESISTOR0603-RES  [SPARKFUN_0603-RES]
R3  620  SPARKFUN_RESISTOR0603-RES  [SPARKFUN_0603-RES]
R4  620  SPARKFUN_RESISTOR0603-RES  [SPARKFUN_0603-RES]
R5  620  SPARKFUN_RESISTOR0603-RES  [SPARKFUN_0603-RES]
R6  620  SPARKFUN_RESISTOR0603-RES  [SPARKFUN_0603-RES]
R7  620  SPARKFUN_RESISTOR0603-RES  [SPARKFUN_0603-RES]
R8  620  SPARKFUN_RESISTOR0603-RES  [SPARKFUN_0603-RES]
R9  620  SPARKFUN_RESISTOR0603-RES  [SPARKFUN_0603-RES]
R10  620  SPARKFUN_RESISTOR0603-RES  [SPARKFUN_0603-RES]
R11  620  SPARKFUN_RESISTOR0603-RES  [SPARKFUN_0603-RES]
R12  620  SPARKFUN_RESISTOR0603-RES  [SPARKFUN_0603-RES]
R13  620  SPARKFUN_RESISTOR0603-RES  [SPARKFUN_0603-RES]
R14  620  SPARKFUN_RESISTOR0603-RES  [SPARKFUN_0603-RES]
R15  620  SPARKFUN_RESISTOR0603-RES  [SPARKFUN_0603-RES]
R16  620  SPARKFUN_RESISTOR0603-RES  [SPARKFUN_0603-RES]
R17  620  SPARKFUN_RESISTOR0603-RES  [SPARKFUN_0603-RES]
R18  620  SPARKFUN_RESISTOR0603-RES  [SPARKFUN_0603-RES]

### Nets
COL1: LED1.C LED19.C LED37.C LED55.C LED73.C LED91.C LED109.C LED127.C LED145.C LED163.C LED181.C LED199.C LED217.C LED235.C LED253.C LED271.C LED289.C LED307.C ; also sheet 1
COL2: LED2.C LED20.C LED38.C LED56.C LED74.C LED92.C LED110.C LED128.C LED146.C LED164.C LED182.C LED200.C LED218.C LED236.C LED254.C LED272.C LED290.C LED308.C ; also sheet 1
COL3: LED3.C LED21.C LED39.C LED57.C LED75.C LED93.C LED111.C LED129.C LED147.C LED165.C LED183.C LED201.C LED219.C LED237.C LED255.C LED273.C LED291.C LED309.C ; also sheet 1
COL4: LED4.C LED22.C LED40.C LED58.C LED76.C LED94.C LED112.C LED130.C LED148.C LED166.C LED184.C LED202.C LED220.C LED238.C LED256.C LED274.C LED292.C LED310.C ; also sheet 1
COL5: LED5.C LED23.C LED41.C LED59.C LED77.C LED95.C LED113.C LED131.C LED149.C LED167.C LED185.C LED203.C LED221.C LED239.C LED257.C LED275.C LED293.C LED311.C ; also sheet 1
COL6: LED6.C LED24.C LED42.C LED60.C LED78.C LED96.C LED114.C LED132.C LED150.C LED168.C LED186.C LED204.C LED222.C LED240.C LED258.C LED276.C LED294.C LED312.C ; also sheet 1
COL7: LED7.C LED25.C LED43.C LED61.C LED79.C LED97.C LED115.C LED133.C LED151.C LED169.C LED187.C LED205.C LED223.C LED241.C LED259.C LED277.C LED295.C LED313.C ; also sheet 1
COL8: LED8.C LED26.C LED44.C LED62.C LED80.C LED98.C LED116.C LED134.C LED152.C LED170.C LED188.C LED206.C LED224.C LED242.C LED260.C LED278.C LED296.C LED314.C ; also sheet 1
COL9: LED9.C LED27.C LED45.C LED63.C LED81.C LED99.C LED117.C LED135.C LED153.C LED171.C LED189.C LED207.C LED225.C LED243.C LED261.C LED279.C LED297.C LED315.C ; also sheet 1
COL10: LED10.C LED28.C LED46.C LED64.C LED82.C LED100.C LED118.C LED136.C LED154.C LED172.C LED190.C LED208.C LED226.C LED244.C LED262.C LED280.C LED298.C LED316.C ; also sheet 1
COL11: LED11.C LED29.C LED47.C LED65.C LED83.C LED101.C LED119.C LED137.C LED155.C LED173.C LED191.C LED209.C LED227.C LED245.C LED263.C LED281.C LED299.C LED317.C ; also sheet 1
COL12: LED12.C LED30.C LED48.C LED66.C LED84.C LED102.C LED120.C LED138.C LED156.C LED174.C LED192.C LED210.C LED228.C LED246.C LED264.C LED282.C LED300.C LED318.C ; also sheet 1
COL13: LED13.C LED31.C LED49.C LED67.C LED85.C LED103.C LED121.C LED139.C LED157.C LED175.C LED193.C LED211.C LED229.C LED247.C LED265.C LED283.C LED301.C LED319.C ; also sheet 1
COL14: LED14.C LED32.C LED50.C LED68.C LED86.C LED104.C LED122.C LED140.C LED158.C LED176.C LED194.C LED212.C LED230.C LED248.C LED266.C LED284.C LED302.C LED320.C ; also sheet 1
COL15: LED15.C LED33.C LED51.C LED69.C LED87.C LED105.C LED123.C LED141.C LED159.C LED177.C LED195.C LED213.C LED231.C LED249.C LED267.C LED285.C LED303.C LED321.C ; also sheet 1
COL16: LED16.C LED34.C LED52.C LED70.C LED88.C LED106.C LED124.C LED142.C LED160.C LED178.C LED196.C LED214.C LED232.C LED250.C LED268.C LED286.C LED304.C LED322.C ; also sheet 1
COL17: LED17.C LED35.C LED53.C LED71.C LED89.C LED107.C LED125.C LED143.C LED161.C LED179.C LED197.C LED215.C LED233.C LED251.C LED269.C LED287.C LED305.C LED323.C ; also sheet 1
COL18: LED18.C LED36.C LED54.C LED72.C LED90.C LED108.C LED126.C LED144.C LED162.C LED180.C LED198.C LED216.C LED234.C LED252.C LED270.C LED288.C LED306.C LED324.C ; also sheet 1
LINE1: LED1.A LED2.A LED3.A LED4.A LED5.A LED6.A LED7.A LED8.A LED9.A LED10.A LED11.A LED12.A LED13.A LED14.A LED15.A LED16.A LED17.A LED18.A Q1/2.6(Q1:C)
LINE2: LED19.A LED20.A LED21.A LED22.A LED23.A LED24.A LED25.A LED26.A LED27.A LED28.A LED29.A LED30.A LED31.A LED32.A LED33.A LED34.A LED35.A LED36.A Q1/2.4(Q2:C)
LINE3: LED37.A LED38.A LED39.A LED40.A LED41.A LED42.A LED43.A LED44.A LED45.A LED46.A LED47.A LED48.A LED49.A LED50.A LED51.A LED52.A LED53.A LED54.A Q3/4.6(Q1:C)
LINE4: LED55.A LED56.A LED57.A LED58.A LED59.A LED60.A LED61.A LED62.A LED63.A LED64.A LED65.A LED66.A LED67.A LED68.A LED69.A LED70.A LED71.A LED72.A Q3/4.4(Q2:C)
LINE5: LED73.A LED74.A LED75.A LED76.A LED77.A LED78.A LED79.A LED80.A LED81.A LED82.A LED83.A LED84.A LED85.A LED86.A LED87.A LED88.A LED89.A LED90.A Q5/6.6(Q1:C)
LINE6: LED91.A LED92.A LED93.A LED94.A LED95.A LED96.A LED97.A LED98.A LED99.A LED100.A LED101.A LED102.A LED103.A LED104.A LED105.A LED106.A LED107.A LED108.A Q5/6.4(Q2:C)
LINE7: LED109.A LED110.A LED111.A LED112.A LED113.A LED114.A LED115.A LED116.A LED117.A LED118.A LED119.A LED120.A LED121.A LED122.A LED123.A LED124.A LED125.A LED126.A Q7/8.6(Q1:C)
LINE8: LED127.A LED128.A LED129.A LED130.A LED131.A LED132.A LED133.A LED134.A LED135.A LED136.A LED137.A LED138.A LED139.A LED140.A LED141.A LED142.A LED143.A LED144.A Q7/8.4(Q2:C)
LINE9: LED145.A LED146.A LED147.A LED148.A LED149.A LED150.A LED151.A LED152.A LED153.A LED154.A LED155.A LED156.A LED157.A LED158.A LED159.A LED160.A LED161.A LED162.A Q9/10.6(Q1:C)
LINE10: LED163.A LED164.A LED165.A LED166.A LED167.A LED168.A LED169.A LED170.A LED171.A LED172.A LED173.A LED174.A LED175.A LED176.A LED177.A LED178.A LED179.A LED180.A Q9/10.4(Q2:C)
LINE11: LED181.A LED182.A LED183.A LED184.A LED185.A LED186.A LED187.A LED188.A LED189.A LED190.A LED191.A LED192.A LED193.A LED194.A LED195.A LED196.A LED197.A LED198.A Q11/12.6(Q1:C)
LINE12: LED199.A LED200.A LED201.A LED202.A LED203.A LED204.A LED205.A LED206.A LED207.A LED208.A LED209.A LED210.A LED211.A LED212.A LED213.A LED214.A LED215.A LED216.A Q11/12.4(Q2:C)
LINE13: LED217.A LED218.A LED219.A LED220.A LED221.A LED222.A LED223.A LED224.A LED225.A LED226.A LED227.A LED228.A LED229.A LED230.A LED231.A LED232.A LED233.A LED234.A Q13/14.6(Q1:C)
LINE14: LED235.A LED236.A LED237.A LED238.A LED239.A LED240.A LED241.A LED242.A LED243.A LED244.A LED245.A LED246.A LED247.A LED248.A LED249.A LED250.A LED251.A LED252.A Q13/14.4(Q2:C)
LINE15: LED253.A LED254.A LED255.A LED256.A LED257.A LED258.A LED259.A LED260.A LED261.A LED262.A LED263.A LED264.A LED265.A LED266.A LED267.A LED268.A LED269.A LED270.A Q15/16.6(Q1:C)
LINE16: LED271.A LED272.A LED273.A LED274.A LED275.A LED276.A LED277.A LED278.A LED279.A LED280.A LED281.A LED282.A LED283.A LED284.A LED285.A LED286.A LED287.A LED288.A Q15/16.4(Q2:C)
LINE17: LED289.A LED290.A LED291.A LED292.A LED293.A LED294.A LED295.A LED296.A LED297.A LED298.A LED299.A LED300.A LED301.A LED302.A LED303.A LED304.A LED305.A LED306.A Q17/18.6(Q1:C)
LINE18: LED307.A LED308.A LED309.A LED310.A LED311.A LED312.A LED313.A LED314.A LED315.A LED316.A LED317.A LED318.A LED319.A LED320.A LED321.A LED322.A LED323.A LED324.A Q17/18.4(Q2:C)
N$2: Q1/2.1(Q1:B) R1.2
N$4: Q1/2.3(Q2:B) R2.2
N$6: Q3/4.1(Q1:B) R3.2
N$8: Q3/4.3(Q2:B) R4.2
N$10: Q5/6.1(Q1:B) R5.2
N$12: Q5/6.3(Q2:B) R6.2
N$14: Q7/8.1(Q1:B) R7.2
N$16: Q7/8.3(Q2:B) R8.2
N$18: Q9/10.1(Q1:B) R9.2
N$20: Q9/10.3(Q2:B) R10.2
N$22: Q11/12.1(Q1:B) R11.2
N$24: Q11/12.3(Q2:B) R12.2
N$26: Q13/14.1(Q1:B) R13.2
N$28: Q13/14.3(Q2:B) R14.2
N$30: Q15/16.1(Q1:B) R15.2
N$32: Q15/16.3(Q2:B) R16.2
N$34: Q17/18.1(Q1:B) R17.2
N$36: Q17/18.3(Q2:B) R18.2
ROW1: R1.1 ; also sheet 1
ROW2: R2.1 ; also sheet 1
ROW3: R3.1 ; also sheet 1
ROW4: R4.1 ; also sheet 1
ROW5: R5.1 ; also sheet 1
ROW6: R6.1 ; also sheet 1
ROW7: R7.1 ; also sheet 1
ROW8: R8.1 ; also sheet 1
ROW9: R9.1 ; also sheet 1
ROW10: R10.1 ; also sheet 1
ROW11: R11.1 ; also sheet 1
ROW12: R12.1 ; also sheet 1
ROW13: R13.1 ; also sheet 1
ROW14: R14.1 ; also sheet 1
ROW15: R15.1 ; also sheet 1
ROW16: R16.1 ; also sheet 1
ROW17: R17.1 ; also sheet 1
ROW18: R18.1 ; also sheet 1
VCC: Q1/2.2(Q2:E) Q1/2.5(Q1:E) Q3/4.2(Q2:E) Q3/4.5(Q1:E) Q5/6.2(Q2:E) Q5/6.5(Q1:E) Q7/8.2(Q2:E) Q7/8.5(Q1:E) Q9/10.2(Q2:E) Q9/10.5(Q1:E) Q11/12.2(Q2:E) Q11/12.5(Q1:E) Q13/14.2(Q2:E) Q13/14.5(Q1:E) Q15/16.2(Q2:E) Q15/16.5(Q1:E) Q17/18.2(Q2:E) Q17/18.5(Q1:E) ; also sheet 1

## Library data of the parts
B2-B5 S1 S2 = SparkFun:SWITCH-MOMENTARY-2
BAT1 BAT2 = Nullspace:NSL_SPARKFUN_BATTERY: Battery Holders Various common sizes : AA, AAA, 20mm coin cell and 12mm coin cell.
C1 C2 C5 C7-C10 = Nullspace:SPARKFUN_CAP: Capacitor Standard 0603 ceramic capacitor, and 0.1" leaded capacitor.
C12 = SparkFun:CAP_POL: Capacitor Polarized These are standard SMD and PTH capacitors. Normally 10uF, 47uF, and 100uF in electrolytic and tantalum varieties. Always verify the external diameter of the through hole cap, it varies with capacity, voltage, and manufacturer. The EIA devices should be standard.
JP1-JP4 R1-R18 RA1-RA4 RA6-RA9 = Nullspace:SPARKFUN_RESISTOR: Resistor Basic schematic elements and footprints for 0603, 1206, and PTH 1/10th watt (small) resistors.
JP5 = SparkFun:M06: Header 6 Standard 6-pin 0.1" header. Use with straight break away headers (SKU : PRT-00116), right angle break away headers (PRT-00553), swiss pins (PRT-00743), machine pins (PRT-00117), and female headers (PRT-00115). Molex polarized connector foot print use with SKU : PRT-08094 with associated crimp pins and housings. NOTES ON THE VARIANTS LOCK and LOCK_LONGPADS... This footprint was designed to help hold the alignment of a through-hole component (i.e. 6-pin header) while soldering it into place. You may notice that each hole has been shifted either up or down by 0.005 of an inch from it's more standard position (which is a perfectly straight line). This slight alteration caused the pins (the squares in the middle) to touch the edges of the holes. Because they are alternating, it causes a "brace" to hold the component in place. 0.005 has proven to be the perfect amount of "off-center" position when using our standard breakaway headers. Although looks a little odd when you look at the bare footprint, once you have a header in there, the alteration is very hard to notice. Also, if you push a header all the way into place, it is covered up entirely on the bottom side. This idea of altering the position of holes to aid alignment will be further integrated into the Sparkfun Library for other footprints. It can help hold any component with 3 or more connection pins.
LED1-LED324 = Nullspace:NSL_SPARKFUN_LED: LEDs Standard schematic elements and footprints for 5mm, 3mm, 1206, and 0603 sized LEDs. 5mm - Spark Fun Electronics SKU : COM-00529 (and others)
Q1/2 Q3/4 Q5/6 Q7/8 Q9/10 Q11/12 Q13/14 Q15/16 Q17/18 = fairchild-semic:FMB3906: FMB3906 This device is designed for general purpose amplifier and switching applications at collector currents of 10 µA to 100 mA
U1 = SparkFun:ATMEGA168
U2 U3 = SparkFun:CD74HC154M: High-Speed CMOS Logic 4- to 16-Line Decoder/Demultiplexer
U4 U5 = Nullspace:STP16DP05MTR: STP16DP05MTR LED Drivers 16-Bit LED Sink w/output error
VR1 VR2 = SparkFun:TRIMPOT
XTL = SparkFun:CRYSTAL: Crystals Various standard crystals. Proven footprints. Spark Fun Electronics SKU : COM-00534